# Altium project ESP-audio-breakout.PrjPcb
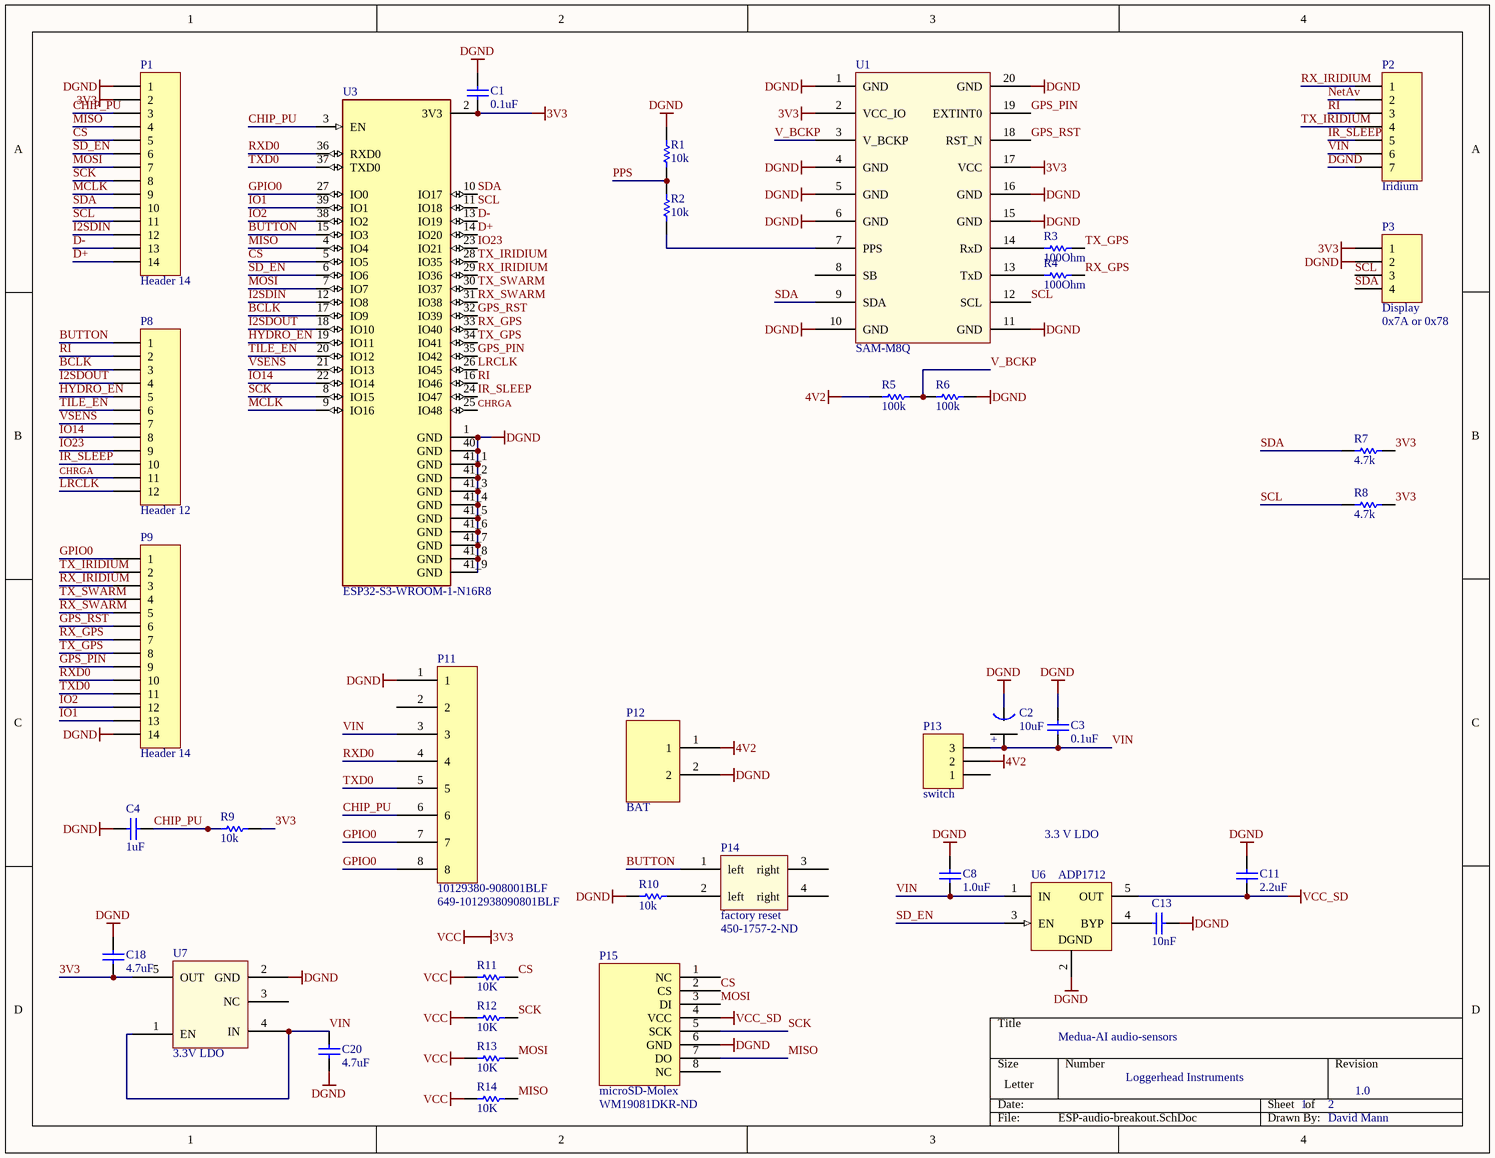
[diagram p0: ESP-audio-breakout.SchDoc]
2 sheets, 85 parts. Net scope: global (net labels, ports and power ports of the same name join across sheets).
Board file: ESP-audio-breakout.PcbDoc
Sheets:
  ESP-audio-breakout.SchDoc
  medusa-ai-audio.SchDoc

## Sheet ESP-audio-breakout.SchDoc
size Letter; SheetNumber: 1; SheetTotal: 2

### Parts
C1  0.1uF  [0402]
C2  10uF  [Tant0805]
C3  0.1uF  [0402]
C4  1uF  [0402]
C8  1.0uF  [0402]
C11  2.2uF  [0402]
C13  10nF  [0402]
C18  4.7uF  [0402]
C20  4.7uF  [0402]
P1  Header 14  [HDR1X14]
P2  Iridium  [HDR1X7]
P3  Display  [HDR1X4]
P8  Header 12  [HDR1X12]
P9  Header 14  [HDR1X14]
P11  10129380-908001BLF  Supplier Part Number 1: 649-1012938090801BLF  [Header_8_SMT]
P12  BAT  [HDR_2x1_2mm]
P13  switch  [HDR1X3]
P14  factory reset  Supplier Part Number 1: 450-1757-2-ND  [SOP4]
P15  microSD-Molex  Supplier Part Number 1: WM19081DKR-ND  [microSD_Molex_hinged]
R1  10k  [3-0603]
R2  10k  [3-0603]
R3  100Ohm  [2-0402]
R4  100Ohm  [2-0402]
R5  100k  [3-0603]
R6  100k  [3-0603]
R7  4.7k  [3-0603]
R8  4.7k  [3-0603]
R9  10k  [2-0402]
R10  10k  [2-0402]
R11  10K  [3-0603]
R12  10K  [3-0603]
R13  10K  [3-0603]
R14  10K  [3-0603]
U1  SAM-M8Q  [GPS SAM-MQ8]
U3  ESP32-S3-WROOM-1-N16R8  [XCVR_ESP32-S3-WROOM-1-N16R2]
U6  ADP1712  [MF05A_N]
U7  3.3V LDO  [AP7361C-33Y5-13]

### Nets
3V3: C1.1 C18.2 P1.2 P3.1 R7.2 R8.2 R9.1 R11.1 R12.1 R13.1 R14.1 U1.2(VCC_IO) U1.17(VCC) U3.2(3V3) U7.5(OUT)  [also labelled VCC]
4V2: P12.1 P13.2 R5.2
DGND: C1.2 C2.1(GND) C3.2 C4.2 C8.2 C11.2 C13.1 C18.1 C20.2 P1.1 P2.7 P3.2 P9.14 P11.1 P12.2 P15.6(GND) R1.1 R6.1 R10.2 U1.1(GND) U1.4(GND) U1.5(GND) U1.6(GND) U1.10(GND) U1.11(GND) U1.15(GND) U1.16(GND) U1.20(GND) U3.1(GND) U3.40(GND) U3.41_1(GND) U3.41_2(GND) U3.41_3(GND) U3.41_4(GND) U3.41_5(GND) U3.41_6(GND) U3.41_7(GND) U3.41_8(GND) U3.41_9(GND) U6.2(GND) U7.2(GND)
VCC_SD: C11.1 P15.4(VCC) U6.5(OUT)
BCLK: P8.3 U3.17(IO9)
BUTTON: P8.1 P14.1(left) U3.15(IO3)
CHIP_PU: C4.1 P1.3 P11.6 R9.2 U3.3(EN)
CHRGA: P8.11 U3.25(IO48)
CS: P1.5 P15.2(CS) R11.2 U3.5(IO5)
D+: P1.14 U3.14(IO20)
D-: P1.13 U3.13(IO19)
GPIO0: P9.1 P11.7 P11.8 U3.27(IO0)
GPS_PIN: P9.9 U1.19(EXTINT0) U3.35(IO42)
GPS_RST: P9.6 U1.18(RST_N) U3.32(IO39)
HYDRO_EN: P8.5 U3.19(IO11)
I2SDIN: P1.12 U3.12(IO8)
I2SDOUT: P8.4 U3.18(IO10)
IO1: P9.13 U3.39(IO1)
IO2: P9.12 U3.38(IO2)
IO14: P8.8 U3.22(IO14)
IO23: P8.9 U3.23(IO21)
IR_SLEEP: P2.5 P8.10 U3.24(IO47)
LRCLK: P8.12 U3.26(IO45)  [project net ES7210_10]
MCLK: P1.9 U3.9(IO16)  [project net ES7210_5]
MISO: P1.4 P15.7(DO) R14.2 U3.4(IO4)
MOSI: P1.7 P15.3(DI) R13.2 U3.7(IO7)
NetAv: P2.2
PPS: R1.2 R2.1
RI: P2.3 P8.2 U3.16(IO46)
RX_GPS: P9.7 R4.1 U3.33(IO40)
RX_IRIDIUM: P2.1 P9.3 U3.29(IO36)
RX_SWARM: P9.5 U3.31(IO38)
RXD0: P9.10 P11.4 U3.36(RXD0)
SCK: P1.8 P15.5(SCK) R12.2 U3.8(IO15)
SCL: P1.11 P3.3 R8.1 U1.12(SCL) U3.11(IO18)  [project net ES7210_4]
SD_EN: P1.6 U3.6(IO6) U6.3(EN)
SDA: P1.10 P3.4 R7.1 U1.9(SDA) U3.10(IO17)  [project net ES7210_3]
TILE_EN: P8.6 U3.20(IO12)
TX_GPS: P9.8 R3.1 U3.34(IO41)
TX_IRIDIUM: P2.4 P9.2 U3.28(IO35)
TX_SWARM: P9.4 U3.30(IO37)
TXD0: P9.11 P11.5 U3.37(TXD0)
V_BCKP: R5.1 R6.2 U1.3(V_BCKP)
VIN: C2.2(+) C3.1 C8.1 C20.1 P2.6 P11.3 P13.3 U6.1(IN) U7.1(EN) U7.4(IN)
VSENS: P8.7 U3.21(IO13)
NetC13_2: C13.2 U6.4(BYP)
NetP14_2: P14.2(left) R10.1
NetR2_2: R2.2 U1.7(PPS)
NetR3_2: R3.2 U1.14(RxD)
NetR4_2: R4.2 U1.13(TxD)

Not connected (* = marked no-connect by the designer): P11 2; P13 1; P14 3(right) 4(right); P15 1(NC) 8(NC); U1 8(SB); U7 3(NC)

### Notes on the sheet
- (near P3) 0x7A or 0x78
- 3.3 V LDO
- Medua-AI audio-sensors
- Loggerhead Instruments
- 1
- 2
- 1.0
- David Mann
- (in symbol LP3985IM5-3.3) DGND

### Library data of the parts
C1 C3 = C0402: Ceramic Chip Capacitor - Standard; Note: Footprint corresponds to dimensions for bulk cassette packaging. This case size has tightened tolerances.; Published: 17-Jul-2002; LatestRevisionDate: 19-Mar-2004; LatestRevisionNote: Silkscreen size reduced.; DatasheetDocument: Mar-2001; PackageDocument: Mar-2001; PackageReference: 0402; Publisher: Altium Limited; Code_JEITA: 0402; Code_IPC: 1005 [0402]; ComponentLink1Description: Manufacturer Link; ComponentLink1URL: http://www.kemet.com/; ComponentLink2Description: Datasheet; ComponentLink2URL: http://www.kemet.com/kemet/web/homepage/kechome.nsf/vapubfilesname/F3102TA.pdf/$file/F3102TA.pdf; Value: 0.1uF
C2 = Tant0805: Value: 10uF
C4 C8 C11 C13 C18 C20 = C0402: Ceramic Chip Capacitor - Standard; Note: Footprint corresponds to dimensions for bulk cassette packaging. This case size has tightened tolerances.; Value: 0.1uF; Published: 17-Jul-2002; LatestRevisionDate: 19-Mar-2004; LatestRevisionNote: Silkscreen size reduced.; DatasheetDocument: Mar-2001; PackageDocument: Mar-2001; PackageReference: 0402; Publisher: Altium Limited; Code_JEITA: 0402; Code_IPC: 1005 [0402]; ComponentLink1Description: Manufacturer Link; ComponentLink1URL: http://www.kemet.com/; ComponentLink2Description: Datasheet; ComponentLink2URL: http://www.kemet.com/kemet/web/homepage/kechome.nsf/vapubfilesname/F3102TA.pdf/$file/F3102TA.pdf
P1 P9 = Header 14: Header, 14-Pin; LatestRevisionDate: 17-Jul-2002; LatestRevisionNote: Re-released for DXP Platform.; Publisher: Altium Limited
P2 = Header 7: Header, 7-Pin; LatestRevisionDate: 17-Jul-2002; LatestRevisionNote: Re-released for DXP Platform.; Publisher: Altium Limited
P3 = Header 4: Header, 4-Pin; LatestRevisionDate: 17-Jul-2002; LatestRevisionNote: Re-released for DXP Platform.; Publisher: Altium Limited
P8 = Header 12: Header, 12-Pin; LatestRevisionDate: 17-Jul-2002; LatestRevisionNote: Re-released for DXP Platform.; Publisher: Altium Limited
P11 = Header8_SMT: Surface mount header; Supplier 1: Mouser
P12 = HDR_2x1_2mm
P13 = Header 3: Header, 3-Pin; LatestRevisionDate: 17-Jul-2002; LatestRevisionNote: Re-released for DXP Platform.; Publisher: Altium Limited
P14 = pushbutton: Supplier 1: Digi-Key
P15 = microSD_Molex_hinged: Supplier 1: Digi-Key
R1 R2 R5-R8 = ERJ3RK: Precision Thick Film Chip Resistor, 10 Ohm to 1M Ohm Range, 1% and 0.5% Tolerance, 0603 Size, 0.063 W; Published: 17-Dec-2003; LatestRevisionDate: 19-Mar-2004; LatestRevisionNote: Silkscreen size reduced.; PackageDocument: Mar-2003; PackageReference: 3-0603; Publisher: Altium Limited; Code_IPC: 1608 [0603]; ComponentLink1Description: Manufacturer Link; ComponentLink1URL: http://www.panasonic.com/industrial/components/resistive_products.htm; ComponentLink2Description: Datasheet; ComponentLink2URL: http://www.panasonic.com/industrial/components/pdf/AOA0000CE2.pdf
R3 R4 R9 R10 = ERJ2RB: Precision Thick Film Chip Resistor, 10 Ohm to 1M Ohm Range, 1% and 0.5% Tolerance, 0402 Size, 0.063 W; Published: 17-Dec-2003; LatestRevisionDate: 19-Mar-2004; LatestRevisionNote: Silkscreen size reduced.; PackageDocument: Mar-2003; PackageReference: 2-0402; Publisher: Altium Limited; Code_IPC: 1005 [0402]; ComponentLink1Description: Manufacturer Link; ComponentLink1URL: http://www.panasonic.com/industrial/components/resistive_products.htm; ComponentLink2Description: Datasheet; ComponentLink2URL: http://www.panasonic.com/industrial/components/pdf/AOA0000CE2.pdf
R11-R14 = ERJ3EK: Precision Thick Film Chip Resistor, 10 Ohm to 1M Ohm Range, 1% and 0.5% Tolerance, 0603 Size, 0.063 W; Published: 17-Dec-2003; LatestRevisionDate: 19-Mar-2004; LatestRevisionNote: Silkscreen size reduced.; PackageDocument: Mar-2003; PackageReference: 3-0603; Publisher: Altium Limited; Code_IPC: 1608 [0603]; ComponentLink1Description: Manufacturer Link; ComponentLink1URL: http://www.panasonic.com/industrial/components/resistive_products.htm; ComponentLink2Description: Datasheet; ComponentLink2URL: http://www.panasonic.com/industrial/components/pdf/AOA0000CE2.pdf
U1 = GPS SAM-M8Q
U3 = ESP32-S3-WROOM-1-N16R2: Bluetooth, WiFi 802.11b/g/n, Bluetooth v5.0 Transceiver Module 2.4GHz PCB Trace Surface Mount; MF: Espressif Systems; Package: None; Availability: In Stock; SnapEDA_Link: https://www.snapeda.com/parts/ESP32-S3-WROOM-1-N16R2/Espressif+Systems/view-part/?ref=snap; MP: ESP32-S3-WROOM-1-N16R2; Value: *; Purchase-URL: https://pricing.snapeda.com/search/part/ESP32-S3-WROOM-1-N16R2/?ref=eda; Price: None; Check_prices: https://www.snapeda.com/parts/ESP32-S3-WROOM-1-N16R2/Espressif+Systems/view-part/?ref=eda
U6 = LP3985IM5-3.3: Micropower, 150mA Low-Noise Ultra Low-Dropout CMOS Voltage Regulator; Manufacturer: National Semiconductor; CompType: LDO IC; PackageTopMarking: LDQB*XTT; PowerWise: N; Published: 4-Dec-2008; DatasheetVersion: Aug-2005; PackageVersion: revD, Aug-2008; PackageReference: MF05A; Publisher: Altium Limited; PackageDescription: Molded SOT-23, .115 x .063 x .040 in Body, 5 Lead, .0375 in Pitch; PartNumber: LP3985IM5-3.3; RoHS: O; PinCount: 5; DigiKeyPartNumber: LP3985IM5-3.3CT-ND; ComponentLink1Description: LP3985 Datasheet; ComponentLink1URL: http://www.national.com/ds/LP/LP3985.pdf; ComponentLink2Description: LP3985 Web Page; ComponentLink2URL: http://www.national.com/pf/LP/LP3985.html; ComponentLink3Description: MF05A Package Page; ComponentLink3URL: http://www.national.com/packaging/folders/mf05a.html
U7 = AP7361C-33Y5-13

## Sheet medusa-ai-audio.SchDoc
size Legal; SheetNumber: 2; SheetTotal: 2
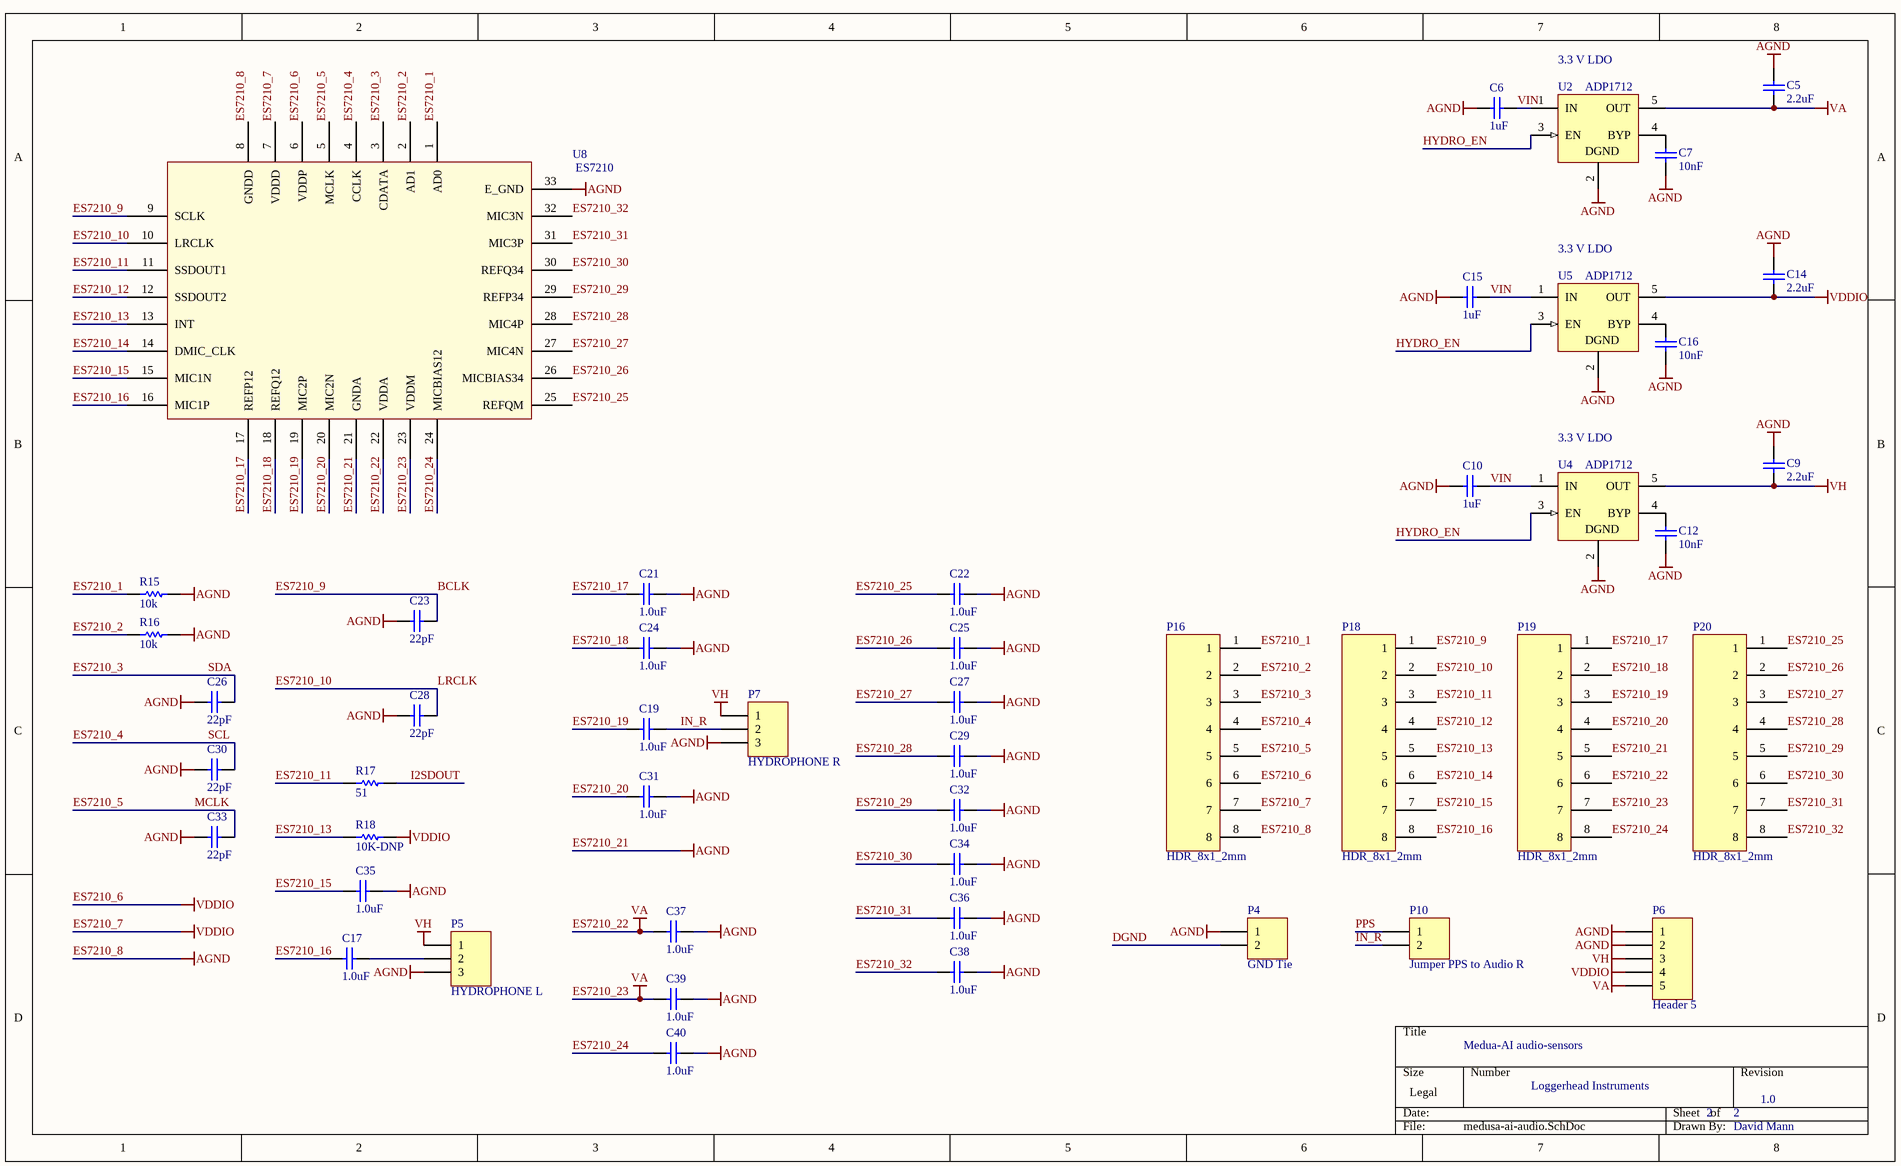
[diagram p1: medusa-ai-audio.SchDoc]

### Parts
C5  2.2uF  [0402]
C6  1uF  [0402]
C7  10nF  [0402]
C9  2.2uF  [0402]
C10  1uF  [0402]
C12  10nF  [0402]
C14  2.2uF  [0402]
C15  1uF  [0402]
C16  10nF  [0402]
C17  1.0uF  [0402]
C19  1.0uF  [0402]
C21  1.0uF  [0402]
C22  1.0uF  [0402]
C23  22pF  [0402]
C24  1.0uF  [0402]
C25  1.0uF  [0402]
C26  22pF  [0402]
C27  1.0uF  [0402]
C28  22pF  [0402]
C29  1.0uF  [0402]
C30  22pF  [0402]
C31  1.0uF  [0402]
C32  1.0uF  [0402]
C33  22pF  [0402]
C34  1.0uF  [0402]
C35  1.0uF  [0402]
C36  1.0uF  [0402]
C37  1.0uF  [0402]
C38  1.0uF  [0402]
C39  1.0uF  [0402]
C40  1.0uF  [0402]
P4  GND Tie  [HDR1X2]
P5  HYDROPHONE L  [HDR1X3]
P6  Header 5  [HDR1X5]
P7  HYDROPHONE R  [HDR1X3]
P10  Jumper PPS to Audio R  [HDR1X2]
P16  HDR_8x1_2mm  [HDR_8x1_2mm]
P18  HDR_8x1_2mm  [HDR_8x1_2mm]
P19  HDR_8x1_2mm  [HDR_8x1_2mm]
P20  HDR_8x1_2mm  [HDR_8x1_2mm]
R15  10k  [3-0603]
R16  10k  [3-0603]
R17  51  [3-0603]
R18  10K-DNP  [3-0603]
U2  ADP1712  [MF05A_N]
U4  ADP1712  [MF05A_N]
U5  ADP1712  [MF05A_N]
U8  ES7210  [ES7210]

### Nets
DGND: P4.2
ES7210_6: C14.1 P6.4 P16.6 P16.7 R18.2 U5.5(OUT) U8.6(VDDP) U8.7(VDDD)  [also labelled ES7210_7, VDDIO]
ES7210_21: C5.2 C6.2 C7.2 C9.2 C10.2 C12.2 C14.2 C15.2 C16.2 C21.1 C22.1 C23.1 C24.1 C25.1 C26.1 C27.1 C28.1 C29.1 C30.1 C31.1 C32.1 C33.1 C34.1 C35.1 C36.1 C37.1 C38.1 C39.1 C40.1 P4.1 P5.3 P6.1 P6.2 P7.3 P16.8 P19.5 R15.2 R16.2 U2.2(GND) U4.2(GND) U5.2(GND) U8.8(GNDD) U8.21(GNDA) U8.33(E_GND)  [also labelled AGND, ES7210_8]
ES7210_22: C5.1 C37.2 C39.2 P6.5 P19.6 P19.7 U2.5(OUT) U8.22(VDDA) U8.23(VDDM)  [also labelled ES7210_23, VA]
VH: C9.1 P5.1 P6.3 P7.1 U4.5(OUT)
BCLK: C23.2 P18.1 U8.9(SCLK)  [also labelled ES7210_9]
ES7210_1: P16.1 R15.1 U8.1(AD0)
ES7210_2: P16.2 R16.1 U8.2(AD1)
ES7210_3: C26.2 P16.3 U8.3(CDATA)  [also labelled SDA]
ES7210_4: C30.2 P16.4 U8.4(CCLK)  [also labelled SCL]
ES7210_5: C33.2 P16.5 U8.5(MCLK)  [also labelled MCLK]
ES7210_10: C28.2 P18.2 U8.10(LRCLK)  [also labelled LRCLK]
ES7210_11: P18.3 R17.1 U8.11(SSDOUT1)
ES7210_12: P18.4 U8.12(SSDOUT2)
ES7210_13: P18.5 R18.1 U8.13(INT)
ES7210_14: P18.6 U8.14(DMIC_CLK)
ES7210_15: C35.2 P18.7 U8.15(MIC1N)
ES7210_16: C17.2 P18.8 U8.16(MIC1P)
ES7210_17: C21.2 P19.1 U8.17(REFP12)
ES7210_18: C24.2 P19.2 U8.18(REFQ12)
ES7210_19: C19.2 P19.3 U8.19(MIC2P)
ES7210_20: C31.2 P19.4 U8.20(MIC2N)
ES7210_24: C40.2 P19.8 U8.24(MICBIAS12)
ES7210_25: C22.2 P20.1 U8.25(REFQM)
ES7210_26: C25.2 P20.2 U8.26(MICBIAS34)
ES7210_27: C27.2 P20.3 U8.27(MIC4N)
ES7210_28: C29.2 P20.4 U8.28(MIC4P)
ES7210_29: C32.2 P20.5 U8.29(REFP34)
ES7210_30: C34.2 P20.6 U8.30(REFQ34)
ES7210_31: C36.2 P20.7 U8.31(MIC3P)
ES7210_32: C38.2 P20.8 U8.32(MIC3N)
HYDRO_EN: U2.3(EN) U4.3(EN) U5.3(EN)
I2SDOUT: R17.2
IN_R: C19.1 P7.2 P10.2
PPS: P10.1
VIN: C6.1 C10.1 C15.1 U2.1(IN) U4.1(IN) U5.1(IN)
NetC7_1: C7.1 U2.4(BYP)
NetC12_1: C12.1 U4.4(BYP)
NetC16_1: C16.1 U5.4(BYP)
NetC17_1: C17.1 P5.2

### Notes on the sheet
- (near U2) 3.3 V LDO
- (near U5) 3.3 V LDO
- (near U4) 3.3 V LDO
- Medua-AI audio-sensors
- Loggerhead Instruments
- 2
- 1.0
- David Mann
- (in symbol LP3985IM5-3.3) DGND

### Library data of the parts
C5-C7 C9 C10 C12 C14-C17 C19 C21-C40 = C0402: as C4 on sheet ESP-audio-breakout; Published: 17-Jul-2002; LatestRevisionDate: 19-Mar-2004; LatestRevisionNote: Silkscreen size reduced.; DatasheetDocument: Mar-2001; PackageDocument: Mar-2001; PackageReference: 0402; Publisher: Altium Limited; Code_JEITA: 0402; Code_IPC: 1005 [0402]; ComponentLink1Description: Manufacturer Link; ComponentLink1URL: http://www.kemet.com/; ComponentLink2Description: Datasheet; ComponentLink2URL: http://www.kemet.com/kemet/web/homepage/kechome.nsf/vapubfilesname/F3102TA.pdf/$file/F3102TA.pdf
P4 P10 = Header 2: Header, 2-Pin; LatestRevisionDate: 17-Jul-2002; LatestRevisionNote: Re-released for DXP Platform.; Publisher: Altium Limited
P5 P7 = Header 3: Header, 3-Pin; LatestRevisionDate: 17-Jul-2002; LatestRevisionNote: Re-released for DXP Platform.; Publisher: Altium Limited
P6 = Header 5: Header, 5-Pin; LatestRevisionDate: 17-Jul-2002; LatestRevisionNote: Re-released for DXP Platform.; Publisher: Altium Limited
R15-R18 = ERJ3RK: as R1 on sheet ESP-audio-breakout; Published: 17-Dec-2003; LatestRevisionDate: 19-Mar-2004; LatestRevisionNote: Silkscreen size reduced.; PackageDocument: Mar-2003; PackageReference: 3-0603; Publisher: Altium Limited; Code_IPC: 1608 [0603]; ComponentLink1Description: Manufacturer Link; ComponentLink1URL: http://www.panasonic.com/industrial/components/resistive_products.htm; ComponentLink2Description: Datasheet; ComponentLink2URL: http://www.panasonic.com/industrial/components/pdf/AOA0000CE2.pdf
U2 U4 U5 = LP3985IM5-3.3: as U6 on sheet ESP-audio-breakout; Published: 4-Dec-2008; DatasheetVersion: Aug-2005; PackageVersion: revD, Aug-2008; PackageReference: MF05A; Publisher: Altium Limited; PackageDescription: Molded SOT-23, .115 x .063 x .040 in Body, 5 Lead, .0375 in Pitch; PartNumber: LP3985IM5-3.3; RoHS: O; PinCount: 5; DigiKeyPartNumber: LP3985IM5-3.3CT-ND; ComponentLink1Description: LP3985 Datasheet; ComponentLink1URL: http://www.national.com/ds/LP/LP3985.pdf; ComponentLink2Description: LP3985 Web Page; ComponentLink2URL: http://www.national.com/pf/LP/LP3985.html; ComponentLink3Description: MF05A Package Page; ComponentLink3URL: http://www.national.com/packaging/folders/mf05a.html
U8 = ES7210: Audio CODEC

## Nets that join several sheets
DGND: ESP-audio-breakout (41 pins), medusa-ai-audio (P4.2)
BCLK: ESP-audio-breakout (P8.3 U3.17), medusa-ai-audio (C23.2 P18.1 U8.9)
ES7210_3: ESP-audio-breakout (5 pins), medusa-ai-audio (C26.2 P16.3 U8.3)
ES7210_4: ESP-audio-breakout (5 pins), medusa-ai-audio (C30.2 P16.4 U8.4)
ES7210_5: ESP-audio-breakout (P1.9 U3.9), medusa-ai-audio (C33.2 P16.5 U8.5)
ES7210_10: ESP-audio-breakout (P8.12 U3.26), medusa-ai-audio (C28.2 P18.2 U8.10)
HYDRO_EN: ESP-audio-breakout (P8.5 U3.19), medusa-ai-audio (U2.3 U4.3 U5.3)
I2SDOUT: ESP-audio-breakout (P8.4 U3.18), medusa-ai-audio (R17.2)
PPS: ESP-audio-breakout (R1.2 R2.1), medusa-ai-audio (P10.1)
VIN: ESP-audio-breakout (10 pins), medusa-ai-audio (6 pins)